# EAGLE schematic HB-UNI-Sen-PM_v1 (EAGLE 8.7.1)
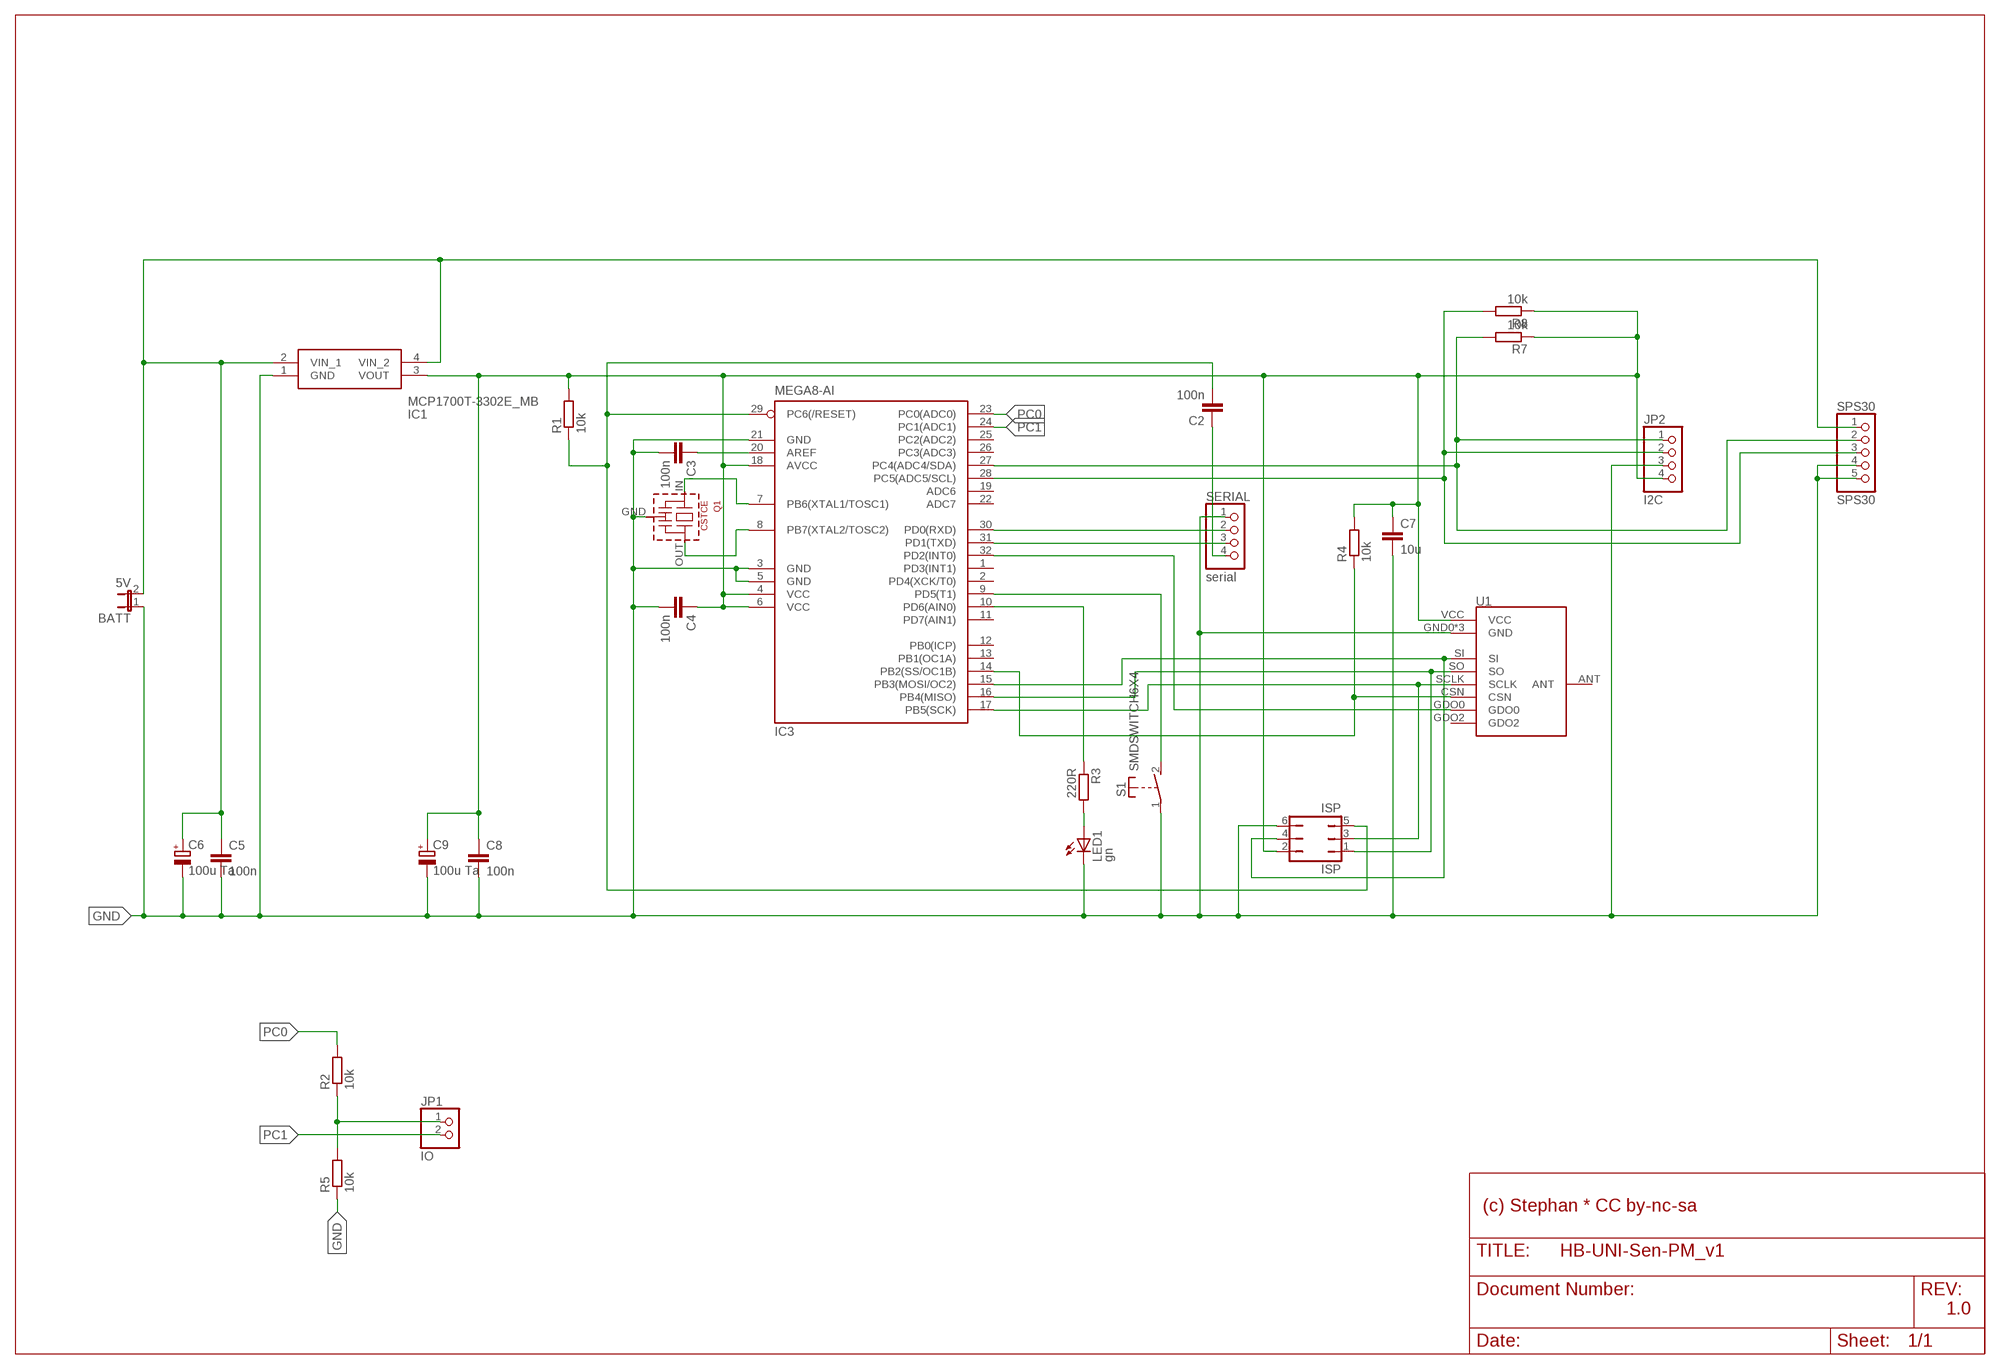
[diagram p0: schematic, sheet 1]

## Parts
BATT  5V  JP1E  [JP1]
C2  100n  C-EUC0805K  [C0805K]
C3  100n  C-EUC0805K  [C0805K]
C4  100n  C-EUC0805K  [C0805K]
C5  100n  C-EUC0805K  [C0805K]
C6  100u Ta  CPOL-EUSANYO_SMD_C6  [SANYO-OSCON_SMD_C6]
C7  10u  C-EUC0805K  [C0805K]
C8  100n  C-EUC0805K  [C0805K]
C9  100u Ta  CPOL-EUSANYO_SMD_C6  [SANYO-OSCON_SMD_C6]
IC1  MCP1700T-3302E_MB  [MCP1700T-3302E/MB]
IC3  MEGA8-AI  [TQFP32-08]
ISP  ISP  JP3Q  [JP3Q]
JP1  IO  PINHD-1X2  [1X02]
JP2  I2C  PINHD-1X4  [1X04]
LED1  gn  LEDCHIPLED_0805  [CHIPLED_0805]
Q1  CSTCE  [CSTCE]
R1  10k  R-EU_R0805W  [R0805W]
R2  10k  R-EU_R0805W  [R0805W]
R3  220R  R-EU_R0805W  [R0805W]
R4  10k  R-EU_R0805W  [R0805W]
R5  10k  R-EU_R0805W  [R0805W]
R7  10k  R-EU_R0805W  [R0805W]
R8  10k  R-EU_R0805W  [R0805W]
S1  SMDSWITCH6X4  [SMDSWITCH6X4]
SERIAL  serial  PINHD-1X4  [1X04]
SPS30  SPS30  PINHD-1X5  [1X05]
U1  CC1101SMD  [CC1101-SMD]

## Nets
3V3: C4.1 C7.1 C8.1 C9.+ IC1.3(VOUT) IC3.4(VCC) IC3.6(VCC) IC3.18(AVCC) ISP.2 JP2.4 R1.2 R4.2 R7.1 R8.1 U1.VCC
5V: BATT.2 C5.1 C6.+ IC1.2(VIN_1) IC1.4(VIN_2) SPS30.1
AREF: C3.1 IC3.20(AREF)
CSN: IC3.14(PB2(SS/OC1B)) R4.1 U1.CSN
DTR: C2.1 SERIAL.4
GDO0: IC3.32(PD2(INT0)) U1.GDO0
GND: BATT.1 C3.2 C4.2 C5.2 C6.- C7.2 C8.2 C9.- IC1.1(GND) IC3.3(GND) IC3.5(GND) IC3.21(GND) ISP.6 JP2.3 LED1.C Q1.GND R5.1 S1.1(P) SERIAL.1 SPS30.4 SPS30.5 U1.GND0(GND) U1.GND1(GND) U1.GND2(GND)
LED1: LED1.A R3.2
MISO: IC3.16(PB4(MISO)) ISP.1 U1.SO
MOSI: IC3.15(PB3(MOSI/OC2)) ISP.4 U1.SI
PC0: IC3.23(PC0(ADC0)) R2.2
PC0DIV: JP1.1 R2.1 R5.2
PC1: IC3.24(PC1(ADC1)) JP1.2
PD5: IC3.9(PD5(T1)) S1.2(S)
PD6: IC3.10(PD6(AIN0)) R3.1
RESET: C2.2 IC3.29(PC6(/RESET)) ISP.5 R1.1
RXD: IC3.30(PD0(RXD)) SERIAL.2
SCL: IC3.28(PC5(ADC5/SCL)) JP2.2 R8.2 SPS30.3
SCLK: IC3.17(PB5(SCK)) ISP.3 U1.SCLK
SDA: IC3.27(PC4(ADC4/SDA)) JP2.1 R7.2 SPS30.2
TXD: IC3.31(PD1(TXD)) SERIAL.3
XTAL1: IC3.7(PB6(XTAL1/TOSC1)) Q1.IN
XTAL2: IC3.8(PB7(XTAL2/TOSC2)) Q1.OUT
Unconnected: IC3.1(PD3(INT1)) IC3.2(PD4(XCK/T0)) IC3.11(PD7(AIN1)) IC3.12(PB0(ICP)) IC3.13(PB1(OC1A)) IC3.19(ADC6) IC3.22(ADC7) IC3.25(PC2(ADC2)) IC3.26(PC3(ADC3)) U1.ANT U1.GDO2

## Notes on the sheet
- (c) Stephan * CC by-nc-sa
- 1.0

## Library data of the parts
BATT = jumper:JP1E: JUMPER
C2-C5 C7 C8 = resistor:C-EU: CAPACITOR, European symbol
C6 C9 = rcl:CPOL-EU: POLARIZED CAPACITOR, European symbol; SPICEPREFIX: C
IC1 = SamacSys_Parts:MCP1700T-3302E_MB: LDO voltage regulator 250mA Isupply 1uA Source: Datasheet <http://ww1.microchip.com/downloads/en/DeviceDoc/20001826C.pdf>; ARROW_PART_NUMBER: MCP1700T-3302E/MB; ARROW_PRICE-STOCK: https://www.arrow.com/en/products/mcp1700t-3302emb/microchip-technology; DESCRIPTION: LDO voltage regulator 250mA Isupply 1uA; HEIGHT: mm; MANUFACTURER_NAME: Microchip; MANUFACTURER_PART_NUMBER: MCP1700T-3302E/MB; MOUSER_PART_NUMBER: 579-MCP1700T3302E/MB; MOUSER_PRICE-STOCK: https://www.mouser.co.uk/ProductDetail/Microchip-Technology/MCP1700T-3302E-MB/?qs=WWgnj3qycfnlJJhwyn%2Fifw%3D%3D
IC3 = atmel:MEGA8: MICROCONTROLLER 8 Kbytes FLASH, 1 kbytes SRAM, 512 bytes EEPROM, USART, 6-channel 10 bit ADC, 2-channel 8 bit ADC Pin compatible with Atmega48, ATMega88, ATMega168 Source: avr.lbr; MPN: ATMEGA8-16AU; OC_FARNELL: 9171371; OC_NEWARK: 73M8863
ISP = jumper:JP3Q: JUMPER
JP1 = pinhead:PINHD-1X2: PIN HEADER
JP2 SERIAL = pinhead:PINHD-1X4: PIN HEADER
LED1 = led:LED: LED OSRAM: - CHIPLED LG R971, LG N971, LY N971, LG Q971, LY Q971, LO R971, LY R971 LH N974, LH R974 LS Q976, LO Q976, LY Q976 LO Q996 - Hyper CHIPLED LW Q18S LB Q993, LB Q99A, LB R99A - SideLED LS A670, LO A670, LY A670, LG A670, LP A670 LB A673, LV A673, LT A673, LW A673 LH A674 LY A675 LS A676, LA A676, LO A676, LY A676, LW A676 LS A679, LY A679, LG A679 - Hyper Micro SIDELED® LS Y876, LA Y876, LO Y876, LY Y876 LT Y87S - SmartLED LW L88C, LW L88S LB L89C, LB L89S, LG L890 LS L89K, LO L89K, LY L89K LS L896, LA L896, LO L896, LY L896 - TOPLED LS T670, LO T670, LY T670, LG T670, LP T670 LSG T670, LSP T670, LSY T670, LOP T670, LYG T670 LG T671, LOG T671, LSG T671 LB T673, LV T673, LT T673, LW T673 LH T674 LS T676, LA T676, LO T676, LY T676, LB T676, LH T676, LSB T676, LW T676 LB T67C, LV T67C, LT T67C, LS T67K, LO T67K, LY T67K, LW E67C LS E67B, LA E67B, LO E67B, LY E67B, LB E67C, LV E67C, LT E67C LW T67C LS T679, LY T679, LG T679 LS T770, LO T770, LY T770, LG T770, LP T770 LB T773, LV T773, LT T773, LW T773 LH T774 LS E675, LA E675, LY E675, LS T675 LS T776, LA T776, LO T776, LY T776, LB T776 LHGB T686 LT T68C, LB T68C - Hyper Mini TOPLED® LB M676 - Mini TOPLED Santana® LG M470 LS M47K, LO M47K, LY M47K Source: http://www.osram.convergy.de LUXEON: - LUMILED® LXK2-PW12-R00, LXK2-PW12-S00, LXK2-PW14-U00, LXK2-PW14-V00 LXK2-PM12-R00, LXK2-PM12-S00, LXK2-PM14-U00 LXK2-PE12-Q00, LXK2-PE12-R00, LXK2-PE12-S00, LXK2-PE14-T00, LXK2-PE14-U00 LXK2-PB12-K00, LXK2-PB12-L00, LXK2-PB12-M00, LXK2-PB14-N00, LXK2-PB14-P00, LXK2-PB14-Q00 LXK2-PR12-L00, LXK2-PR12-M00, LXK2-PR14-Q00, LXK2-PR14-R00 LXK2-PD12-Q00, LXK2-PD12-R00, LXK2-PD12-S00 LXK2-PH12-R00, LXK2-PH12-S00 LXK2-PL12-P00, LXK2-PL12-Q00, LXK2-PL12-R00 Source: www.luxeon.com KINGBRIGHT: KA-3528ASYC Source: www.kingbright.com
Q1 = murata-cstcc-cstce-cstcr-cstcv-resonators:CSTCE: Murata CSTCE Resonator - 3,2 x 1,3 mm
R1-R5 R7 R8 = resistor:R-EU_: RESISTOR, European symbol
S1 = StephansLib:SMDSWITCH6X4
SPS30 = pinhead:PINHD-1X5: PIN HEADER
U1 = modules:CC1101